# EAGLE schematic Board_v1 (EAGLE 9.2.2)
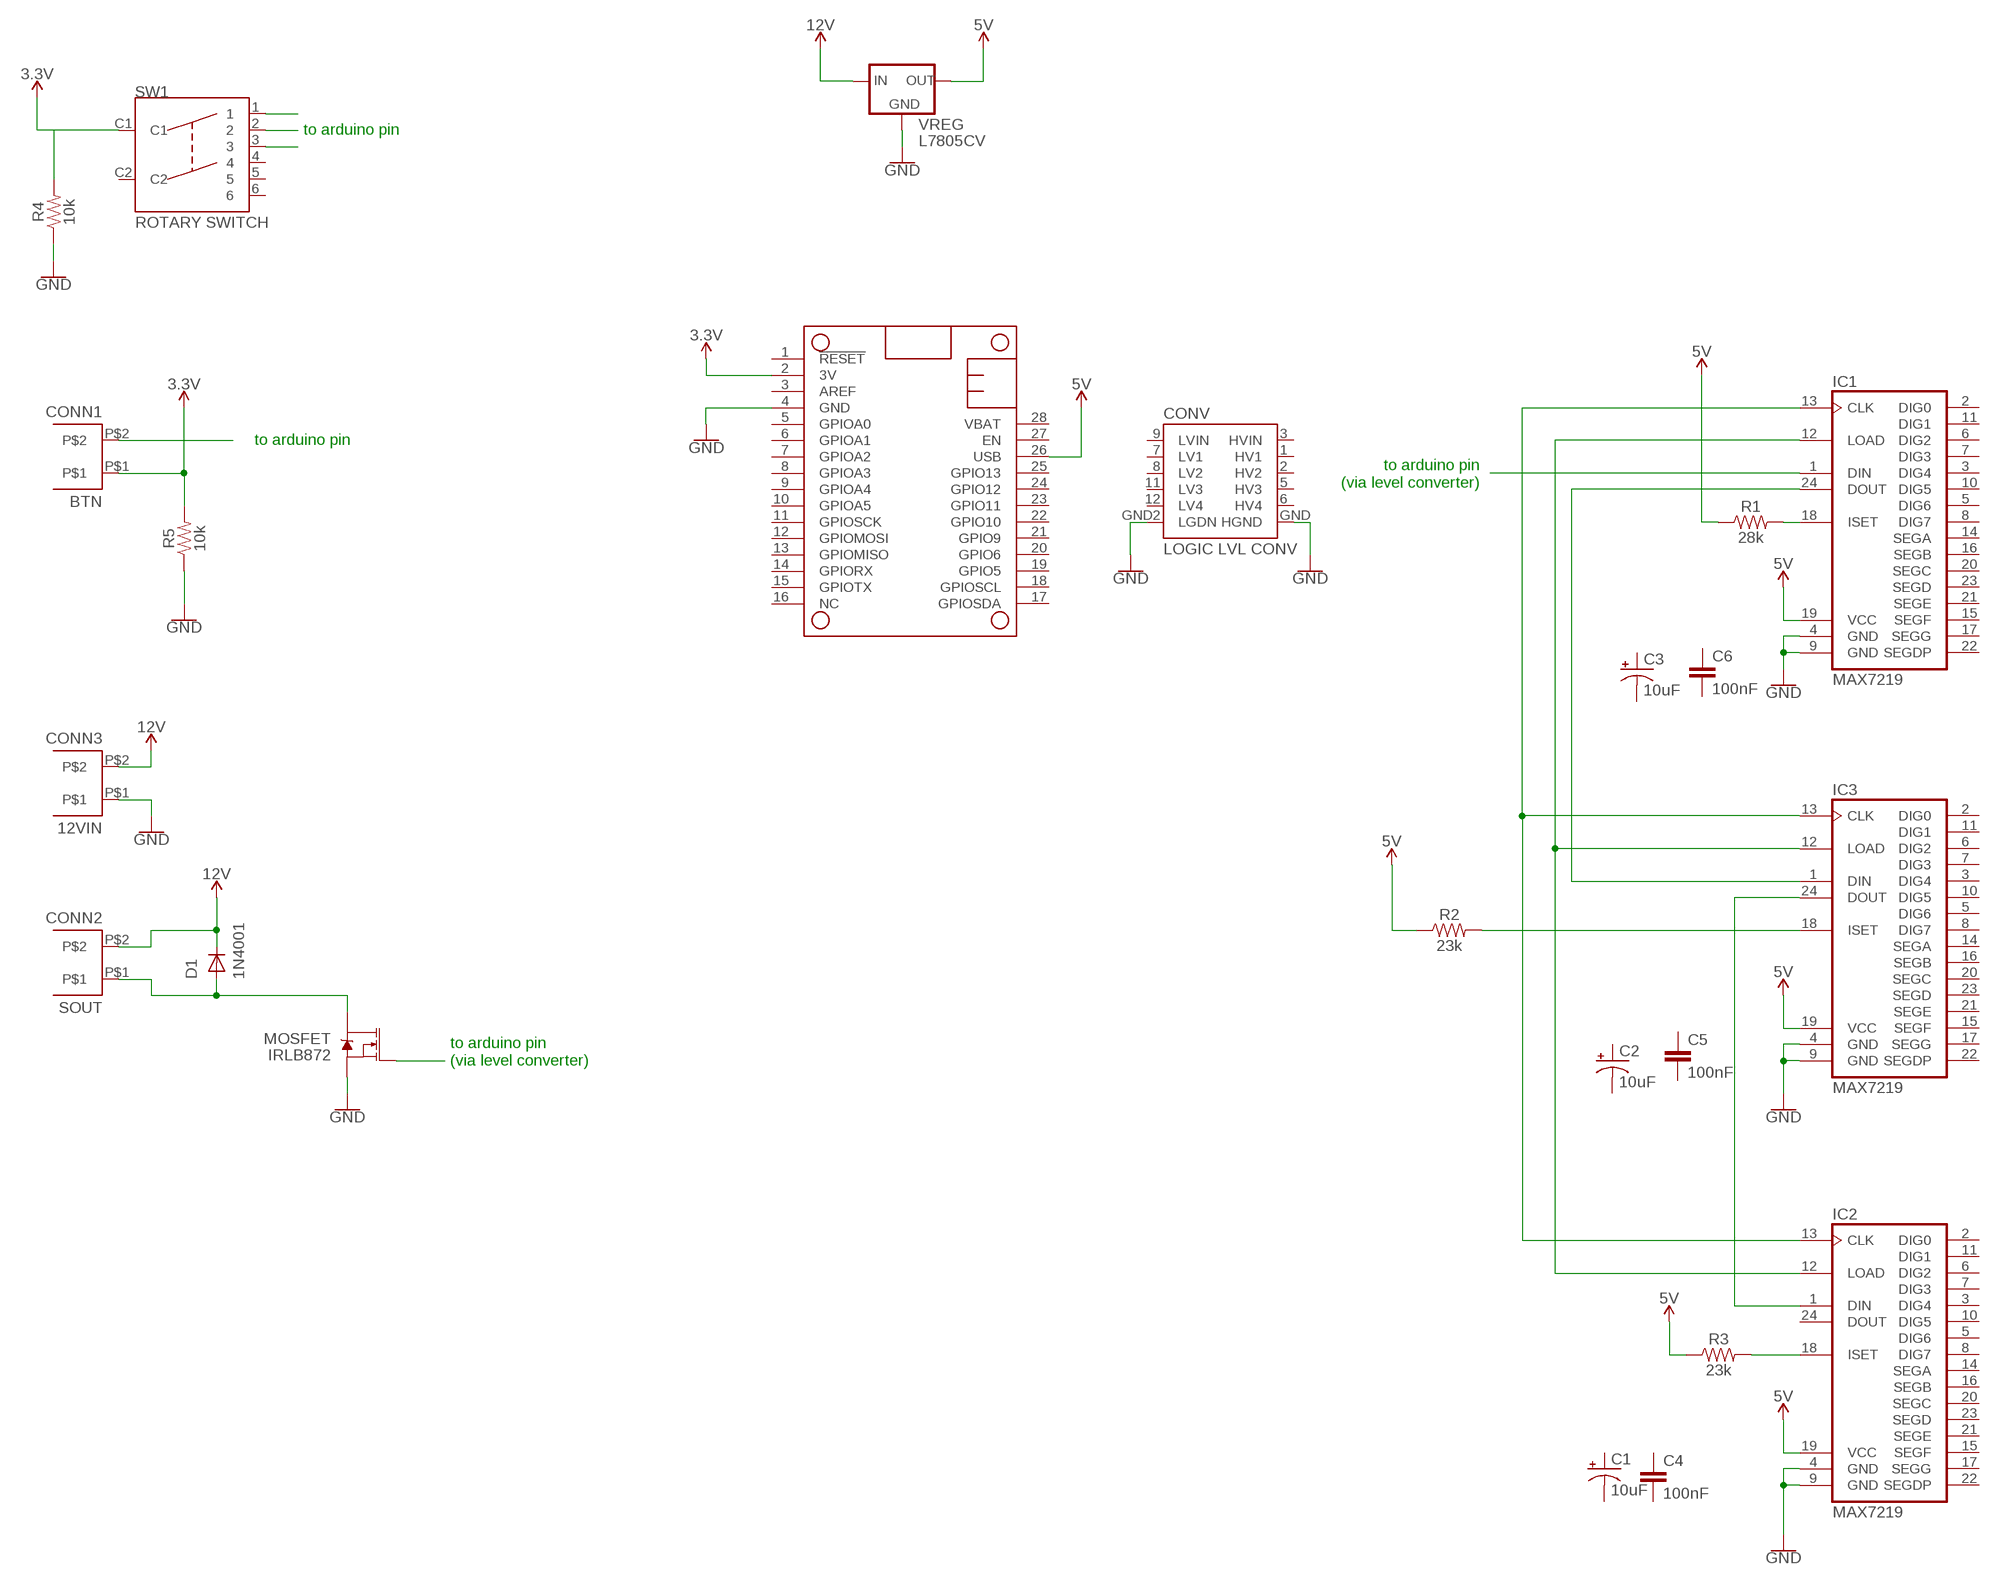
[diagram p0: schematic, sheet 1, part 1 of 3]
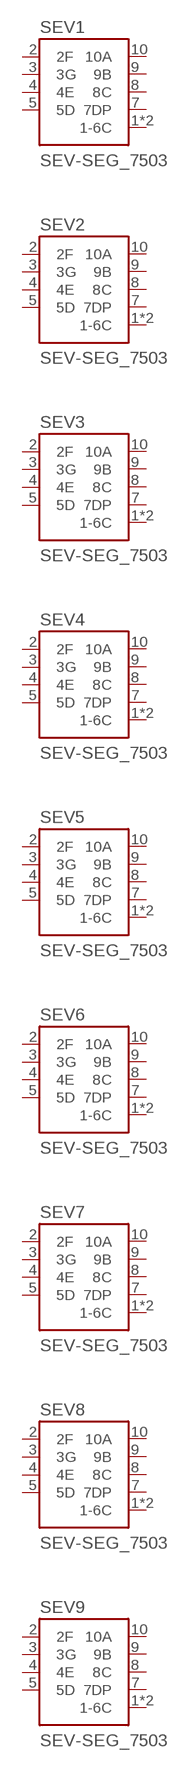
[diagram p1: schematic, sheet 1, part 2 of 3]
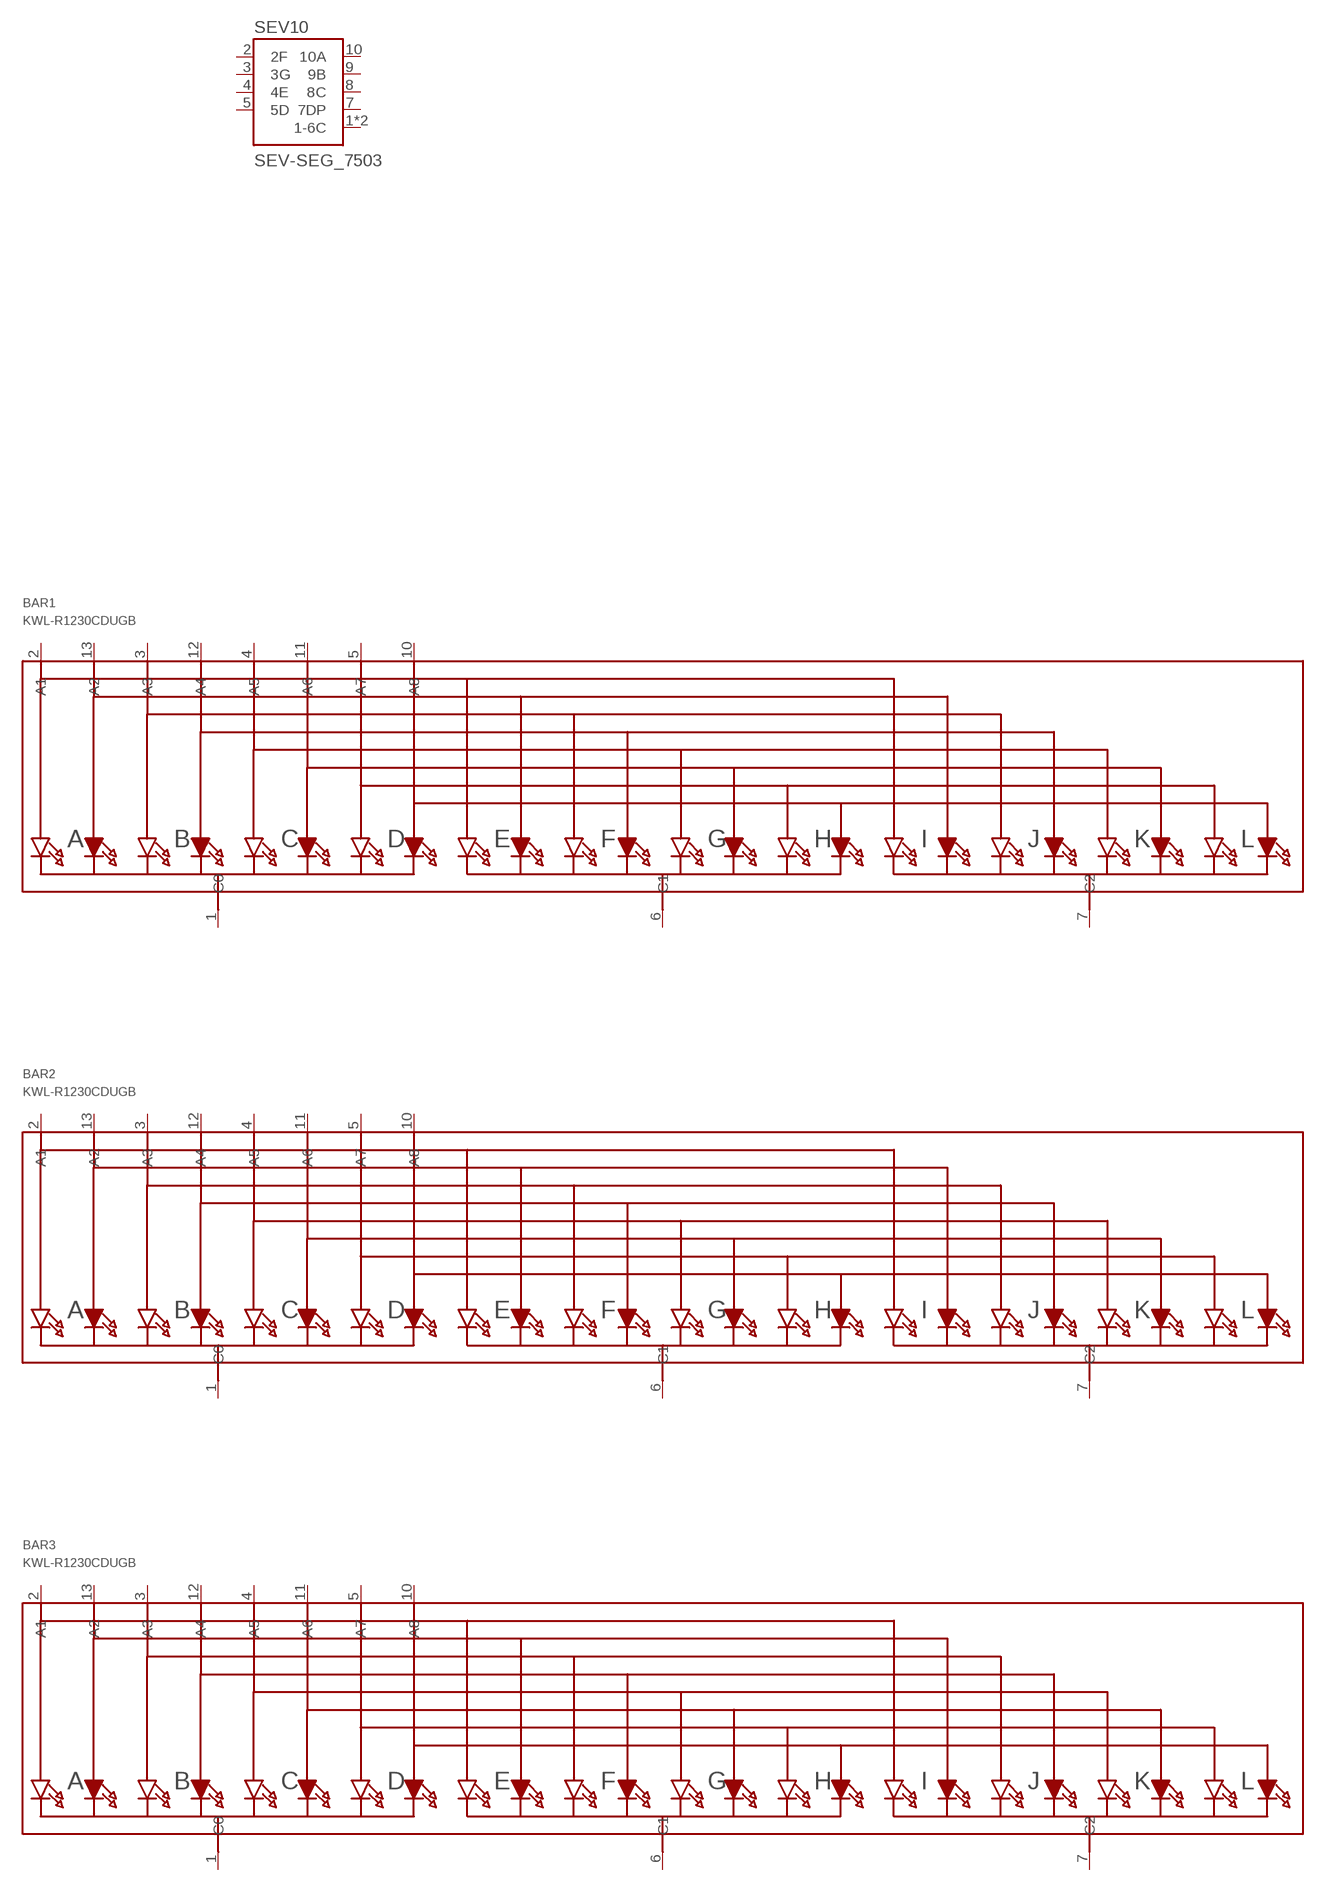
[diagram p2: schematic, sheet 1, part 3 of 3]

## Parts
12VIN  CONN3  MICRO-FIT_3.0_43650  [MICRO-FIT_43560_3MM]
BAR1  KWL-R1230CDUGB  [SEGMENT_BICOL_BL-AR12Z3010]
BAR2  KWL-R1230CDUGB  [SEGMENT_BICOL_BL-AR12Z3010]
BAR3  KWL-R1230CDUGB  [SEGMENT_BICOL_BL-AR12Z3010]
BTN  CONN1  MICRO-FIT_3.0_43650  [MICRO-FIT_43560_3MM]
C1  10uF  CAP_POL  [CPOL-RADIAL-2.5MM-5MM-KIT]
C2  10uF  CAP_POL  [CPOL-RADIAL-2.5MM-5MM-KIT]
C3  10uF  CAP_POL  [CPOL-RADIAL-2.5MM-5MM-KIT]
C4  100nF  CAP_CERAMIC  [CAP-PTH-5MM]
C5  100nF  CAP_CERAMIC  [CAP-PTH-5MM]
C6  100nF  CAP_CERAMIC  [CAP-PTH-5MM]
CONV  LOGIC LVL CONV  3-5V_LOGIC_LVL_CONV  [3-5V_LOGIC_LVL_CONV]
D1  1N4001  [CASE59−10-AXIAL]
FEATHERM0  FEATHERWING_NODIM  [FEATHER]
IC1  MAX7219  MAX7219CNG  [DIL24-3]
IC2  MAX7219  MAX7219CNG  [DIL24-3]
IC3  MAX7219  MAX7219CNG  [DIL24-3]
MOSFET  IRLB872  [TO-220-ALT]
R1  28k  RESISTOR  [AXIAL-0.3]
R2  23k  RESISTOR  [AXIAL-0.3]
R3  23k  RESISTOR  [AXIAL-0.3]
R4  10k  RESISTOR  [AXIAL-0.3]
R5  10k  RESISTOR  [AXIAL-0.3]
SEV1  SEV-SEG_7503  [HDSP-7503-C]
SEV2  SEV-SEG_7503  [HDSP-7503-C]
SEV3  SEV-SEG_7503  [HDSP-7503-C]
SEV4  SEV-SEG_7503  [HDSP-7503-C]
SEV5  SEV-SEG_7503  [HDSP-7503-C]
SEV6  SEV-SEG_7503  [HDSP-7503-C]
SEV7  SEV-SEG_7503  [HDSP-7503-C]
SEV8  SEV-SEG_7503  [HDSP-7503-C]
SEV9  SEV-SEG_7503  [HDSP-7503-C]
SEV10  SEV-SEG_7503  [HDSP-7503-C]
SOUT  CONN2  MICRO-FIT_3.0_43650  [MICRO-FIT_43560_3MM]
SW1  ROTARY SWITCH  MRB_ROTARY_SWITCH  [MRB24B_SP3T]
VREG  L7805CV  [TO-220-ALT]

## Nets
3.3V: BTN.P$1 FEATHERM0.2(3V) R5.P$2
5V: FEATHERM0.26(USB) IC1.19(VCC) IC2.19(VCC) IC3.19(VCC) R1.P$1 R2.P$1 R3.P$1 VREG.OUT
12V: 12VIN.P$2 D1.CAT(C) SOUT.P$2 VREG.IN
GND: 12VIN.P$1 CONV.GND2(LGDN) CONV.GND(HGND) FEATHERM0.4(GND) IC1.4(GND) IC1.9(GND) IC2.4(GND) IC2.9(GND) IC3.4(GND) IC3.9(GND) MOSFET.OUT(S) R4.P$1 R5.P$1 VREG.GND
N$1: IC1.18(ISET) R1.P$2
N$2: D1.ANOD(A) MOSFET.GND(D) SOUT.P$1
N$3: MOSFET.IN(G)
N$4: SW1.1
N$5: SW1.2
N$6: SW1.3
N$7: R4.P$2 SW1.C1
N$8: IC2.18(ISET) R3.P$2
N$9: IC3.18(ISET) R2.P$2
N$10: IC1.13(CLK) IC2.13(CLK) IC3.13(CLK)
N$11: IC1.12(LOAD) IC2.12(LOAD) IC3.12(LOAD)
N$12: IC1.1(DIN)
N$13: IC1.24(DOUT) IC3.1(DIN)
N$14: IC2.1(DIN) IC3.24(DOUT)
N$16: BTN.P$2
Unconnected: BAR1.1(C0) BAR1.2(A1) BAR1.3(A3) BAR1.4(A5) BAR1.5(A7) BAR1.6(C1) BAR1.7(C2) BAR1.10(A8) BAR1.11(A6) BAR1.12(A4) BAR1.13(A2) BAR2.1(C0) BAR2.2(A1) BAR2.3(A3) BAR2.4(A5) BAR2.5(A7) BAR2.6(C1) BAR2.7(C2) BAR2.10(A8) BAR2.11(A6) BAR2.12(A4) BAR2.13(A2) BAR3.1(C0) BAR3.2(A1) BAR3.3(A3) BAR3.4(A5) BAR3.5(A7) BAR3.6(C1) BAR3.7(C2) BAR3.10(A8) BAR3.11(A6) BAR3.12(A4) BAR3.13(A2) C1.1(+) C1.2(-) C2.1(+) C2.2(-) C3.1(+) C3.2(-) C4.1 C4.2 C5.1 C5.2 C6.1 C6.2 CONV.1(HV1) CONV.2(HV2) CONV.3(HVIN) CONV.5(HV3) CONV.6(HV4) CONV.7(LV1) CONV.8(LV2) CONV.9(LVIN) CONV.11(LV3) CONV.12(LV4) FEATHERM0.1(!RESET) FEATHERM0.3(AREF) FEATHERM0.5(GPIOA0) FEATHERM0.6(GPIOA1) FEATHERM0.7(GPIOA2) FEATHERM0.8(GPIOA3) FEATHERM0.9(GPIOA4) FEATHERM0.10(GPIOA5) FEATHERM0.11(GPIOSCK) FEATHERM0.12(GPIOMOSI) FEATHERM0.13(GPIOMISO) FEATHERM0.14(GPIORX) FEATHERM0.15(GPIOTX) FEATHERM0.16(NC) FEATHERM0.17(GPIOSDA) FEATHERM0.18(GPIOSCL) FEATHERM0.19(GPIO5) FEATHERM0.20(GPIO6) FEATHERM0.21(GPIO9) FEATHERM0.22(GPIO10) FEATHERM0.23(GPIO11) FEATHERM0.24(GPIO12) FEATHERM0.25(GPIO13) FEATHERM0.27(EN) FEATHERM0.28(VBAT) IC1.2(DIG0) IC1.3(DIG4) IC1.5(DIG6) IC1.6(DIG2) IC1.7(DIG3) IC1.8(DIG7) IC1.10(DIG5) IC1.11(DIG1) IC1.14(SEGA) IC1.15(SEGF) IC1.16(SEGB) IC1.17(SEGG) IC1.20(SEGC) IC1.21(SEGE) IC1.22(SEGDP) IC1.23(SEGD) IC2.2(DIG0) IC2.3(DIG4) IC2.5(DIG6) IC2.6(DIG2) IC2.7(DIG3) IC2.8(DIG7) IC2.10(DIG5) IC2.11(DIG1) IC2.14(SEGA) IC2.15(SEGF) IC2.16(SEGB) IC2.17(SEGG) IC2.20(SEGC) IC2.21(SEGE) IC2.22(SEGDP) IC2.23(SEGD) IC2.24(DOUT) IC3.2(DIG0) IC3.3(DIG4) IC3.5(DIG6) IC3.6(DIG2) IC3.7(DIG3) IC3.8(DIG7) IC3.10(DIG5) IC3.11(DIG1) IC3.14(SEGA) IC3.15(SEGF) IC3.16(SEGB) IC3.17(SEGG) IC3.20(SEGC) IC3.21(SEGE) IC3.22(SEGDP) IC3.23(SEGD) SEV1.1(1-6C) SEV1.2(2F) SEV1.3(3G) SEV1.4(4E) SEV1.5(5D) SEV1.6(1-6C) SEV1.7(7DP) SEV1.8(8C) SEV1.9(9B) SEV1.10(10A) SEV2.1(1-6C) SEV2.2(2F) SEV2.3(3G) SEV2.4(4E) SEV2.5(5D) SEV2.6(1-6C) SEV2.7(7DP) SEV2.8(8C) SEV2.9(9B) SEV2.10(10A) SEV3.1(1-6C) SEV3.2(2F) SEV3.3(3G) SEV3.4(4E) SEV3.5(5D) SEV3.6(1-6C) SEV3.7(7DP) SEV3.8(8C) SEV3.9(9B) SEV3.10(10A) SEV4.1(1-6C) SEV4.2(2F) SEV4.3(3G) SEV4.4(4E) SEV4.5(5D) SEV4.6(1-6C) SEV4.7(7DP) SEV4.8(8C) SEV4.9(9B) SEV4.10(10A) SEV5.1(1-6C) SEV5.2(2F) SEV5.3(3G) SEV5.4(4E) SEV5.5(5D) SEV5.6(1-6C) SEV5.7(7DP) SEV5.8(8C) SEV5.9(9B) SEV5.10(10A) SEV6.1(1-6C) SEV6.2(2F) SEV6.3(3G) SEV6.4(4E) SEV6.5(5D) SEV6.6(1-6C) SEV6.7(7DP) SEV6.8(8C) SEV6.9(9B) SEV6.10(10A) SEV7.1(1-6C) SEV7.2(2F) SEV7.3(3G) SEV7.4(4E) SEV7.5(5D) SEV7.6(1-6C) SEV7.7(7DP) SEV7.8(8C) SEV7.9(9B) SEV7.10(10A) SEV8.1(1-6C) SEV8.2(2F) SEV8.3(3G) SEV8.4(4E) SEV8.5(5D) SEV8.6(1-6C) SEV8.7(7DP) SEV8.8(8C) SEV8.9(9B) SEV8.10(10A) SEV9.1(1-6C) SEV9.2(2F) SEV9.3(3G) SEV9.4(4E) SEV9.5(5D) SEV9.6(1-6C) SEV9.7(7DP) SEV9.8(8C) SEV9.9(9B) SEV9.10(10A) SEV10.1(1-6C) SEV10.2(2F) SEV10.3(3G) SEV10.4(4E) SEV10.5(5D) SEV10.6(1-6C) SEV10.7(7DP) SEV10.8(8C) SEV10.9(9B) SEV10.10(10A) SW1.4 SW1.5 SW1.6 SW1.C2

## Notes on the sheet
- to arduino pin
- to arduino pin
- to arduino pin
  (via level converter)
- to arduino pin
  (via level converter)

## Library data of the parts
12VIN BTN SOUT = AES_lib:MICRO-FIT_3.0_43650
BAR1-BAR3 = AES_lib:KWL-R1230CDUGB
C1-C3 = AES_lib:CAP_POL
C4-C6 = AES_lib:CAP_CERAMIC
CONV = AES_lib:3-5V_LOGIC_LVL_CONV
D1 = AES_lib:1N4001
FEATHERM0 = AES_lib:FEATHERWING
IC1-IC3 = AES_lib:MAX7219CNG: LED DISPLAY DRIVER; MF: MAXIM; MPN: MAX7219CNG; OC_FARNELL: 1523914; OC_NEWARK: 34C4018
MOSFET = AES_lib:IRLB872
R1-R5 = AES_lib:RESISTOR
SEV1-SEV10 = AES_lib:SEV-SEG_7503
SW1 = AES_lib:MRB_ROTARY_SWITCH
VREG = AES_lib:L7805CV